# EAGLE design Frisbee (EAGLE 9.3.2)

## Sheet 1 of 2
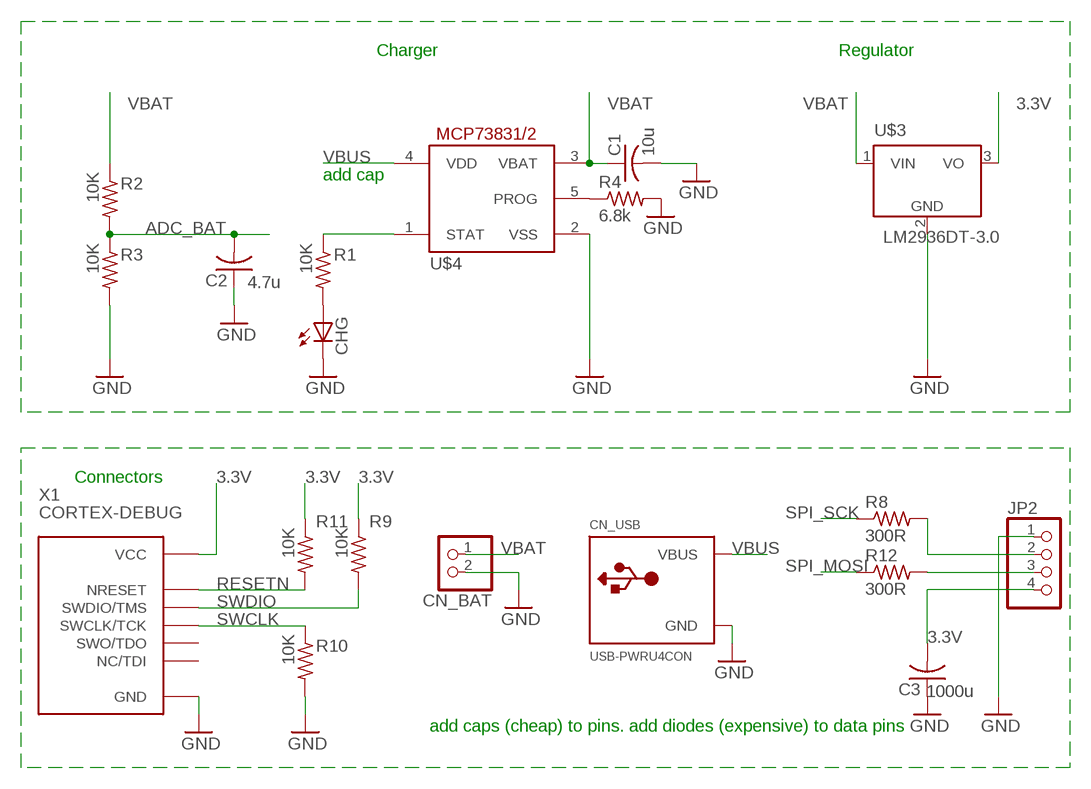
[diagram p0: schematic, sheet 1]

### Parts
C1  10u  C-USC0805  [C0805]
C2  4.7u  C-USC0805  [C0805]
C3  1000u  C-USC0805  [C0805]
CHG  LEDCHIP-LED0603  [CHIP-LED0603]
CN_BAT  JST_2PIN-SMT-RA  [JST-PH-2-SMT-RA]
CN_USB  USB-PWRU4CON  [USB-MINIB-THM-PWRONLY]
JP2  PINHD-1X4/90  [1X04/90]
R1  10K  R-US_R0603  [R0603]
R2  10K  R-US_R0603  [R0603]
R3  10K  R-US_R0603  [R0603]
R4  6.8k  R-US_R0805  [R0805]
R8  300R  R-US_R0805  [R0805]
R9  10K  R-US_R0603  [R0603]
R10  10K  R-US_R0603  [R0603]
R11  10K  R-US_R0603  [R0603]
R12  300R  R-US_R0805  [R0805]
U$3  LM2936DT-3.0  [TO252]
U$4  MCP73831/OT  [SOT23-5L]
X1  CORTEX-DEBUG  [CORTEX-DEBUG]

### Nets
3.3V [3.3]: C3.2 JP2.4 R9.1 R11.1 U$3.3(VO) X1.VCC ; also sheet 2
ADC_BAT: C2.2 R2.2 R3.1 ; also sheet 2
GND [gnd]: C1.2 C2.1 C3.1 CHG.C CN_BAT.2 CN_USB.GND JP2.1 R3.2 R4.2 R10.2 U$3.2(GND) U$4.2(VSS) X1.GND1(GND) X1.GND2(GND) X1.GND_DETECT(GND) ; also sheet 2
N$2: CHG.A R1.2
N$5: R1.1 U$4.1(STAT)
N$6: R4.1 U$4.5(PROG)
N$11: JP2.3 R12.2
N$12: JP2.2 R8.2
RESETN: R11.2 X1.NRESET ; also sheet 2
SPI_MOSI: R12.1 ; also sheet 2
SPI_SCK: R8.1 ; also sheet 2
SWCLK: R10.1 X1.SWCLK/TCK ; also sheet 2
SWDIO: R9.2 X1.SWDIO/TMS ; also sheet 2
VBAT [3.3]: C1.1 CN_BAT.1 R2.1 U$3.1(VIN) U$4.3(VBAT)
VBUS [3.3]: CN_USB.VBUS U$4.4(VDD)
Unconnected: X1.NC/TDI X1.SWO/TDO

### Notes on the sheet
- Charger | Regulator
- add cap
- Connectors
- add caps (cheap) to pins. add diodes (expensive) to data pins

## Sheet 2 of 2
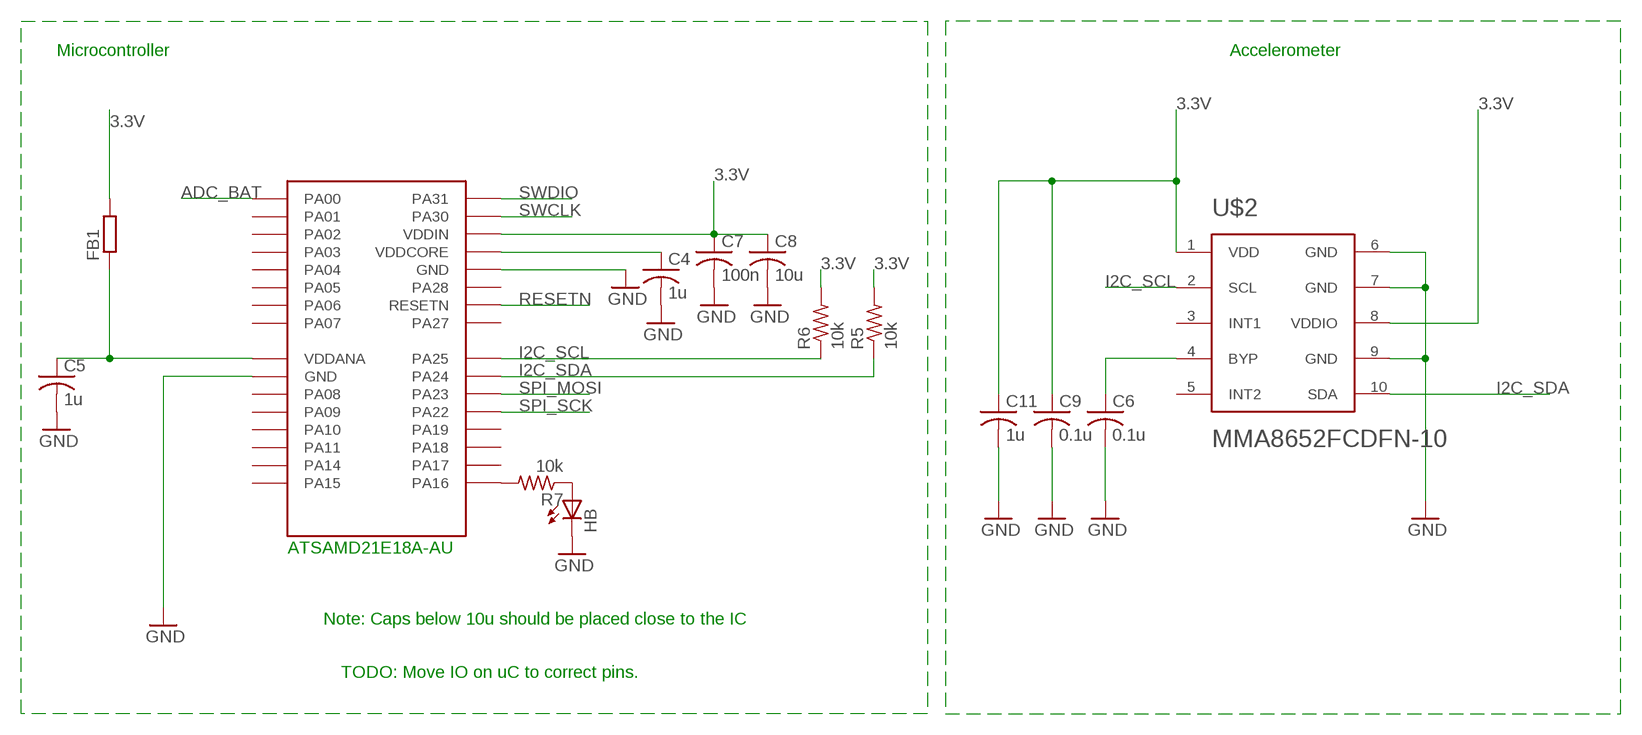
[diagram p1: schematic, sheet 2]

### Parts
C4  1u  C-USC0603  [C0603]
C5  1u  C-USC0603  [C0603]
C6  0.1u  C-USC0603  [C0603]
C7  100n  C-USC0603  [C0603]
C8  10u  C-USC0603  [C0603]
C9  0.1u  C-USC0603  [C0603]
C11  1u  C-USC0603  [C0603]
FB1  R-EU_M0805  [M0805]
HB  LEDCHIPLED_0603  [CHIPLED_0603]
R5  10k  R-US_R0603  [R0603]
R6  10k  R-US_R0603  [R0603]
R7  10k  R-US_R0603  [R0603]
U$1  ATSAMD21E18A-AU  [32-TQFP]
U$2  MMA8652FCDFN-10  [DFN-10]

### Nets
3.3V [3.3]: C7.1 C8.1 C9.1 C11.1 FB1.2 R5.2 R6.2 U$1.30(VDDIN) U$2.1(VDD) U$2.8(VDDIO) ; also sheet 1
ADC_BAT: U$1.1(PA00) ; also sheet 1
GND [gnd]: C4.2 C5.2 C6.2 C7.2 C8.2 C9.2 C11.2 HB.C U$1.10(GND) U$1.28(GND) U$2.6(GND) U$2.7(GND) U$2.9(GND) ; also sheet 1
I2C_SCL: R6.1 U$1.24(PA25) U$2.2(SCL)
I2C_SDA: R5.1 U$1.23(PA24) U$2.10(SDA)
N$7: C4.1 U$1.29(VDDCORE)
N$8: R7.2 U$1.17(PA16)
N$9: HB.A R7.1
N$10: C6.1 U$2.4(BYP)
NOT3.3: C5.1 FB1.1 U$1.9(VDDANA)
RESETN: U$1.26(RESETN) ; also sheet 1
SPI_MOSI: U$1.22(PA23) ; also sheet 1
SPI_SCK: U$1.21(PA22) ; also sheet 1
SWCLK: U$1.31(PA30) ; also sheet 1
SWDIO: U$1.32(PA31) ; also sheet 1
Unconnected: U$1.2(PA01) U$1.3(PA02) U$1.4(PA03) U$1.5(PA04) U$1.6(PA05) U$1.7(PA06) U$1.8(PA07) U$1.11(PA08) U$1.12(PA09) U$1.13(PA10) U$1.14(PA11) U$1.15(PA14) U$1.16(PA15) U$1.18(PA17) U$1.19(PA18) U$1.20(PA19) U$1.25(PA27) U$1.27(PA28) U$2.3(INT1) U$2.5(INT2)

### Notes on the sheet
- Microcontroller | Accelerometer
- ATSAMD21E18A-AU
- Note: Caps below 10u should be placed close to the IC
- TODO: Move IO on uC to correct pins.

## Library data of the parts
C1-C9 C11 = rcl:C-US: CAPACITOR, American symbol; SPICEPREFIX: C
CHG HB = adafruit:LED: LED OSRAM: - CHIPLED LG R971, LG N971, LY N971, LG Q971, LY Q971, LO R971, LY R971 LH N974, LH R974 LS Q976, LO Q976, LY Q976 LO Q996 - Hyper CHIPLED LW Q18S LB Q993, LB Q99A, LB R99A - SideLED LS A670, LO A670, LY A670, LG A670, LP A670 LB A673, LV A673, LT A673, LW A673 LH A674 LY A675 LS A676, LA A676, LO A676, LY A676, LW A676 LS A679, LY A679, LG A679 - Hyper Micro SIDELED® LS Y876, LA Y876, LO Y876, LY Y876 LT Y87S - SmartLED LW L88C, LW L88S LB L89C, LB L89S, LG L890 LS L89K, LO L89K, LY L89K LS L896, LA L896, LO L896, LY L896 - TOPLED LS T670, LO T670, LY T670, LG T670, LP T670 LSG T670, LSP T670, LSY T670, LOP T670, LYG T670 LG T671, LOG T671, LSG T671 LB T673, LV T673, LT T673, LW T673 LH T674 LS T676, LA T676, LO T676, LY T676, LB T676, LH T676, LSB T676, LW T676 LB T67C, LV T67C, LT T67C, LS T67K, LO T67K, LY T67K, LW E67C LS E67B, LA E67B, LO E67B, LY E67B, LB E67C, LV E67C, LT E67C LW T67C LS T679, LY T679, LG T679 LS T770, LO T770, LY T770, LG T770, LP T770 LB T773, LV T773, LT T773, LW T773 LH T774 LS E675, LA E675, LY E675, LS T675 LS T776, LA T776, LO T776, LY T776, LB T776 LHGB T686 LT T68C, LB T68C - Hyper Mini TOPLED® LB M676 - Mini TOPLED Santana® LG M470 LS M47K, LO M47K, LY M47K Source: http://www.osram.convergy.de/
CN_BAT = adafruit:JST_2PIN: JST 2-Pin Connectors of various flavors SMT-RA (S2B-PH-SM4) 4UConnector #17311 SMT (B2B-PH-SM4) THM-RA (S2B-PH) THM (B2B-PH)
CN_USB = adafruit:USB-PWR
FB1 = rcl:R-EU_: RESISTOR, European symbol; SPICEPREFIX: R
JP2 = pinhead:PINHD-1X4: PIN HEADER
R1-R12 = rcl:R-US_: RESISTOR, American symbol; SPICEPREFIX: R
U$1 = atmelSamd:ATSAMD21E18A-AU
U$2 = MMA8652FC:MMA8652FC
U$3 = national-semiconductor:LM2936?*: Ultra-Low Quiescent Current LDO Voltage Regulator Source: Data sheet <http://www.national.com/ds/LM/LM2936.pdf>; MF: NATIONAL SEMICONDUCTOR; MPN: LM2936DT-3.0; OC_FARNELL: 1286862; OC_NEWARK: 74C4101
U$4 = adafruit:MCP73831: MCP73831/2 Miniature Single-Cell, Fully Integrated Li-Ion, Li-Polymer Charge Management Controllers. Nice and small simple lipoly charge controller, with adjustable current and status output (LED) http://www.ladyada.net/library/pcb/eaglelibrary.html
X1 = debug-connectors:CORTEX-DEBUG

## Net classes
0 default: width 0.152 mm, clearance 0.152 mm
1 gnd: width 0.305 mm, clearance 0.152 mm
2 3.3: width 0.305 mm, clearance 0.152 mm

## Board
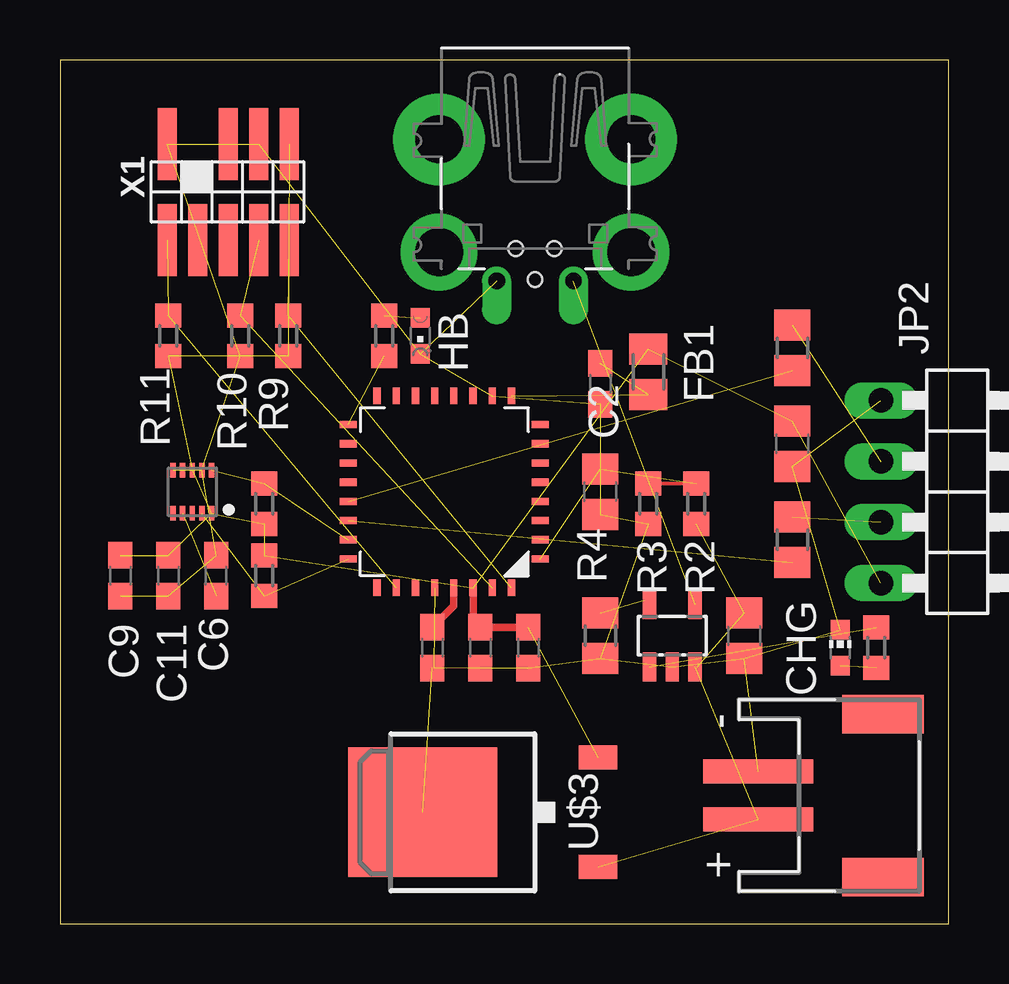
[diagram p2: board, top side]

Size 37.04 x 36 mm. Coordinates in mm from the lower left corner, seen from the top.
Outline: 0.01,0 37.04,0 37.02,36 0,36 0.01,0
Copper layers (1*16): Top 0.035mm / dielectric 1.5mm / Bottom 0.035mm
Design rules "default": minimum track width 6mil, minimum drill 0.35mm, track to track 6mil, track to pad 6mil, pad to pad 6mil, via to via 6mil, smd to smd 6mil, copper to edge 40mil, drill to drill 6mil, minimum pad ring 10mil, minimum via ring 8mil, stop-mask expansion 4mil, vias tented up to drill 0mil, thermal gap 10mil

### Footprints (pad centres in the part's own frame; a part is rotated, then mirrored left to right if it is on the bottom)
C0805 = smd 1.3 x 1.5: 1 -0.95,0; 2 0.95,0
C0603 = smd 1.1 x 1: 1 -0.85,0; 2 0.85,0
CHIP-LED0603 = smd 0.8 x 0.8: A 0,-0.75; C 0,0.75
JST-PH-2-SMT-RA = smd 1 x 4.6: 1 1,-3.7; 2 -1,-3.7 | smd 1.6 x 3.4: NC1 -3.4,1.5; NC2 3.4,1.5
USB-MINIB-THM-PWRONLY = drill 0.7 offset: GND 1.6,4.72; VBUS -1.6,4.72 | drill 2 pad 3.81: GND1 -4,-1.18; GND4 4,-1.18 | drill 2 pad 3.2: GND2 -4,3.52; GND3 4,3.52 | hole 0.6: -0.8,3.37; 0.8,3.37; 0,4.67
M0805 = smd 1.3 x 1.6: 1 -0.95,0; 2 0.95,0
CHIPLED_0603 = smd 0.8 x 0.8: A 0,-0.75; C 0,0.75
1X04/90 = drill 1.016 long: 1 -3.81,-3.81; 2 -1.27,-3.81; 3 1.27,-3.81; 4 3.81,-3.81
R0603 = smd 1 x 1.1: 1 -0.85,0; 2 0.85,0
R0805 = smd 1.3 x 1.5: 1 -0.95,0; 2 0.95,0
32-TQFP = smd 0.7 x 0.3: 1 -4,2.8; 2 -4,2; 3 -4,1.2; 4 -4,0.4; 5 -4,-0.4; 6 -4,-1.2; 7 -4,-2; 8 -4,-2.8; 17 4,-2.8; 18 4,-2; 19 4,-1.2; 20 4,-0.4; 21 4,0.4; 22 4,1.2; 23 4,2; 24 4,2.8 | smd 0.3 x 0.7: 9 -2.8,-4; 10 -2,-4; 11 -1.2,-4; 12 -0.4,-4; 13 0.4,-4; 14 1.2,-4; 15 2,-4; 16 2.8,-4; 25 2.8,4; 26 2,4; 27 1.2,4; 28 0.4,4; 29 -0.4,4; 30 -1.2,4; 31 -2,4; 32 -2.8,4
DFN-10 = smd 0.225 x 0.6: 1 -0.8,0.9; 2 -0.4,0.9; 3 0,0.9; 4 0.4,0.9; 5 0.8,0.9; 6 0.8,-0.9; 7 0.4,-0.9; 8 0,-0.9; 9 -0.4,-0.9; 10 -0.8,-0.9
TO252 = smd 1 x 1.6: 1 -2.28,-4.8; 3 2.28,-4.8 | smd 5.4 x 6.2: 2 0,2.5
SOT23-5L = smd 0.55 x 1.2: 1 -0.95,-1.3; 2 0,-1.3; 3 0.95,-1.3; 4 0.95,1.3; 5 -0.95,1.3
CORTEX-DEBUG = smd 0.8 x 3: GND1 -1.27,-2; GND2 0,-2; GND_DETECT 2.54,-2; NC/TDI 1.27,2; NRESET 2.54,2; SWCLK/TCK -1.27,2; SWDIO/TMS -2.54,2; SWO/TDO 0,2; VCC -2.54,-2

### Placement (x,y rotation side)
C1  28.51,12 270 top
C2  22.51,18 90 top
C3  30.51,20 90 top
C4  15.51,11.5 270 top
C5  22.51,22.5 270 top
C6  6.51,14.5 90 top
C7  17.51,11.5 270 top
C8  19.51,11.5 270 top
C9  2.51,14.5 270 top
C11  4.51,14.5 270 top
CHG  32.51,11.5 0 top
CN_BAT  32.79,5.33 270 top
CN_USB  19.79,31.51 180 top
FB1  24.51,23 90 top
HB  15.01,24.5 180 top
JP2  38.01,18 270 top
R1  34.01,11.5 270 top
R2  26.51,17.5 90 top
R3  24.51,17.5 270 top
R4  22.51,12 270 top
R5  8.51,17.5 270 top
R6  8.51,14.5 90 top
R7  13.51,24.5 270 top
R8  30.51,24 90 top
R9  9.51,24.5 90 top
R10  7.51,24.5 270 top
R11  4.51,24.5 90 top
R12  30.51,16 90 top
U$1  16.01,18 180 top
U$2  5.51,18 180 top
U$3  17.62,4.64 90 top
U$4  25.51,12 0 top
X1  7.01,30.5 180 top

### Tracks (layer width: path | path; a pad name or v marks a point on that pad's centre or on a via)
3.3V  (13 unrouted)
  Top 0.152: 17.51,12.21 C7.1
  Top 0.305: C8.1 C7.1 17.21,12.65 U$1.30
ADC_BAT  (2 unrouted)
  Top 0.152: R2.2 R3.1
GND  (27 unrouted)
  Top 0.152: 15.56,10.69 C4.2 15.41,10.69 | 17.51,10.69 C7.2
I2C_SCL  (2 unrouted)
I2C_SDA  (2 unrouted)
N$2  (1 unrouted)
N$5  (1 unrouted)
N$6  (1 unrouted)
  Top 0.152: U$4.5 24.36,13.5
N$7
  Top 0.305: U$1.29 16.41,13.25 C4.1
N$8  (1 unrouted)
N$9  (1 unrouted)
N$10  (1 unrouted)
N$11  (1 unrouted)
N$12  (1 unrouted)
NOT3.3  (2 unrouted)
RESETN  (2 unrouted)
SPI_MOSI  (1 unrouted)
SPI_SCK  (1 unrouted)
SWCLK  (2 unrouted)
SWDIO  (2 unrouted)
VBAT  (4 unrouted)
  Top 0.305: U$4.3 26.55,10.7
VBUS  (1 unrouted)